# Altium schematic sheet 06-RTL8111H-1.schdoc
size A2
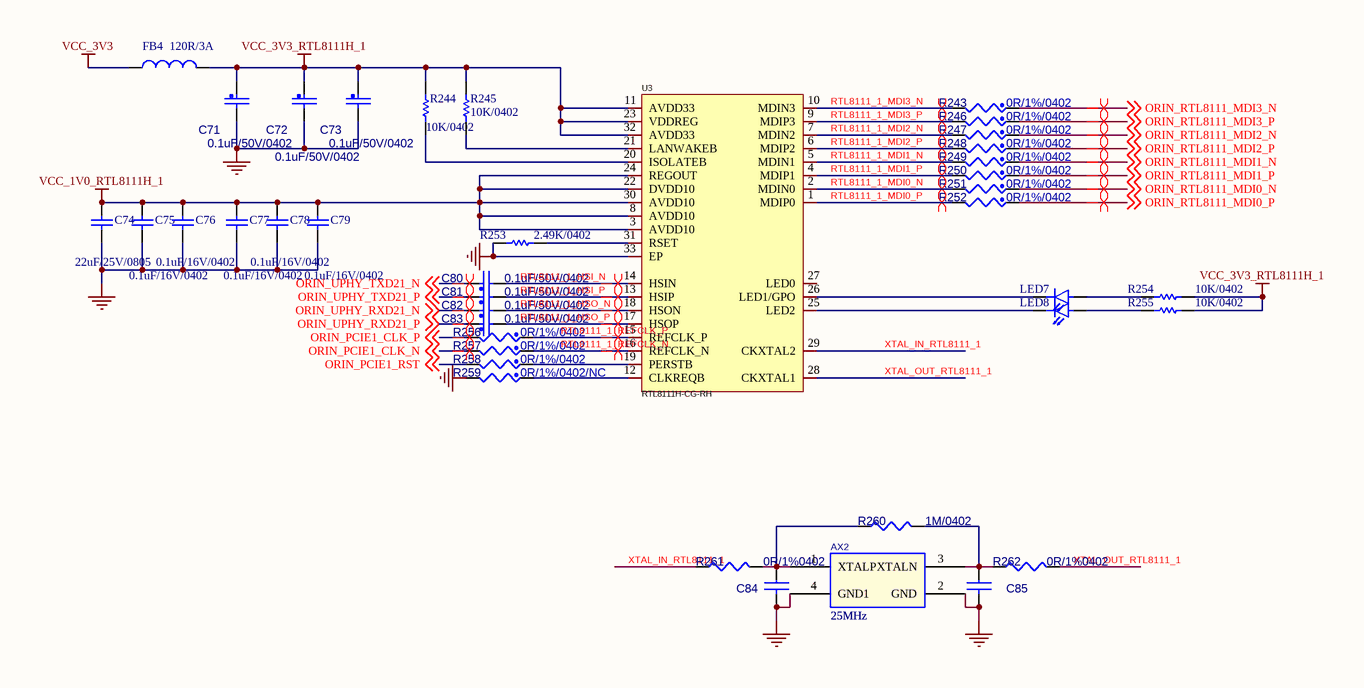
[diagram p0: 06-RTL8111H-1.schdoc]

## Parts
AX2  25MHz  [2016]
C71  value 0.1uF/50V/0402  [C0402]  (hidden comment: CAP_NP)
C72  value 0.1uF/50V/0402  [C0402]  (hidden comment: CAP_NP)
C73  value 0.1uF/50V/0402  [C0402]  (hidden comment: CAP_NP)
C74  22uF/25V/0805  [C0805]
C75  0.1uF/16V/0402  [C0402]
C76  0.1uF/16V/0402  [C0402]
C77  0.1uF/16V/0402  [C0402]
C78  0.1uF/16V/0402  [C0402]
C79  0.1uF/16V/0402  [C0402]
C80  value 0.1uF/50V/0402  [C0402]  (hidden comment: CAP_NP)
C81  value 0.1uF/50V/0402  [C0402]  (hidden comment: CAP_NP)
C82  value 0.1uF/50V/0402  [C0402]  (hidden comment: CAP_NP)
C83  value 0.1uF/50V/0402  [C0402]  (hidden comment: CAP_NP)
C84  CAP NP_Dup3  [C0402]  (value not drawn)
C85  CAP NP_Dup3  [C0402]  (value not drawn)
FB4  120R/3A  [L0603]
LED7  LED_GREEN  [LED0603]  (value not drawn)
LED8  LED_GREEN  [LED0603]  (value not drawn)
R243  value 0R/1%/0402  [R0402]  (hidden comment: RES_Dup2)
R244  10K/0402  [R0402]
R245  10K/0402  [R0402]
R246  value 0R/1%/0402  [R0402]  (hidden comment: RES_Dup2)
R247  value 0R/1%/0402  [R0402]  (hidden comment: RES_Dup2)
R248  value 0R/1%/0402  [R0402]  (hidden comment: RES_Dup2)
R249  value 0R/1%/0402  [R0402]  (hidden comment: RES_Dup2)
R250  value 0R/1%/0402  [R0402]  (hidden comment: RES_Dup2)
R251  value 0R/1%/0402  [R0402]  (hidden comment: RES_Dup2)
R252  value 0R/1%/0402  [R0402]  (hidden comment: RES_Dup2)
R253  2.49K/0402  [R0402]
R254  10K/0402  [R0402]
R255  10K/0402  [R0402]
R256  value 0R/1%/0402  [R0402]  (hidden comment: RES_Dup2)
R257  value 0R/1%/0402  [R0402]  (hidden comment: RES_Dup2)
R258  value 0R/1%/0402  [R0402]  (hidden comment: RES_Dup2)
R259  value 0R/1%/0402/NC  [R0402]  (hidden comment: RES_Dup2)
R260  value 1M/0402  [R0402]  (hidden comment: R_Dup3)
R261  value 0R/1%0402  [R0402]  (hidden comment: R_Dup3)
R262  value 0R/1%0402  [R0402]  (hidden comment: R_Dup3)
U3  RTL8111H-CG-RH  [RTL8111H-CG-RH]

## Nets
GND: AX2.2(GND) AX2.4(GND1) C71.2 C72.2 C73.2 C74.1 C75.1 C76.1 C77.1 C78.1 C79.1 C84.2 C85.2 R253.1 R259.2 U3.33(EP)
VCC_1V0_RTL8111H_1: C74.2 C75.2 C76.2 C77.2 C78.2 C79.2 U3.3(AVDD10) U3.8(AVDD10) U3.22(DVDD10) U3.24(REGOUT) U3.30(AVDD10)
VCC_3V3: FB4.1
VCC_3V3_RTL8111H_1: C71.1 C72.1 C73.1 FB4.2 R244.1 R245.1 R254.1 R255.1 U3.11(AVDD33) U3.23(VDDREG) U3.32(AVDD33)
ORIN_PCIE1_CLK_N: R257.2 ; off-sheet ORIN_PCIE1_CLK_N
ORIN_PCIE1_CLK_P: R256.2 ; off-sheet ORIN_PCIE1_CLK_P
ORIN_PCIE1_RST: R258.2 ; off-sheet ORIN_PCIE1_RST
ORIN_RTL8111_MDI0_N: R251.1 ; off-sheet ORIN_RTL8111_MDI0_N
ORIN_RTL8111_MDI0_P: R252.1 ; off-sheet ORIN_RTL8111_MDI0_P
ORIN_RTL8111_MDI1_N: R249.1 ; off-sheet ORIN_RTL8111_MDI1_N
ORIN_RTL8111_MDI1_P: R250.1 ; off-sheet ORIN_RTL8111_MDI1_P
ORIN_RTL8111_MDI2_N: R247.1 ; off-sheet ORIN_RTL8111_MDI2_N
ORIN_RTL8111_MDI2_P: R248.1 ; off-sheet ORIN_RTL8111_MDI2_P
ORIN_RTL8111_MDI3_N: R243.1 ; off-sheet ORIN_RTL8111_MDI3_N
ORIN_RTL8111_MDI3_P: R246.1 ; off-sheet ORIN_RTL8111_MDI3_P
ORIN_UPHY_RXD21_N: C82.1 ; off-sheet ORIN_UPHY_RXD21_N
ORIN_UPHY_RXD21_P: C83.1 ; off-sheet ORIN_UPHY_RXD21_P
ORIN_UPHY_TXD21_N: C80.1 ; off-sheet ORIN_UPHY_TXD21_N
ORIN_UPHY_TXD21_P: C81.1 ; off-sheet ORIN_UPHY_TXD21_P
RTL8111_1_HSI_N: C80.2 U3.14(HSIN)
RTL8111_1_HSI_P: C81.2 U3.13(HSIP)
RTL8111_1_HSO_N: C82.2 U3.18(HSON)
RTL8111_1_HSO_P: C83.2 U3.17(HSOP)
RTL8111_1_MDI0_N: R251.2 U3.2(MDIN0)
RTL8111_1_MDI0_P: R252.2 U3.1(MDIP0)
RTL8111_1_MDI1_N: R249.2 U3.5(MDIN1)
RTL8111_1_MDI1_P: R250.2 U3.4(MDIP1)
RTL8111_1_MDI2_N: R247.2 U3.7(MDIN2)
RTL8111_1_MDI2_P: R248.2 U3.6(MDIP2)
RTL8111_1_MDI3_N: R243.2 U3.10(MDIN3)
RTL8111_1_MDI3_P: R246.2 U3.9(MDIP3)
RTL8111_1_REFCLK_N: R257.1 U3.16(REFCLK_N)
RTL8111_1_REFCLK_P: R256.1 U3.15(REFCLK_P)
XTAL_IN_RTL8111_1: R261.1 U3.29(CKXTAL2)
XTAL_OUT_RTL8111_1: R262.2 U3.28(CKXTAL1)
NetAX2_1: AX2.1(XTALP) C84.1 R260.1 R261.2
NetAX2_3: AX2.3(XTALN) C85.1 R260.2 R262.1
NetLED7_1: LED7.1 R254.2
NetLED7_2: LED7.2 U3.26(LED1/GPO)
NetLED8_1: LED8.1 R255.2
NetLED8_2: LED8.2 U3.25(LED2)
NetR244_2: R244.2 U3.20(ISOLATEB)
NetR245_2: R245.2 U3.21(LANWAKEB)
NetR253_2: R253.2 U3.31(RSET)
NetR258_1: R258.1 U3.19(PERSTB)
NetR259_1: R259.1 U3.12(CLKREQB)

Not connected (* = marked no-connect by the designer): U3 27(LED0)

## Layout directives
differential pair: ORIN_PCIE1_CLK_N, ORIN_PCIE1_CLK_P, ORIN_RTL8111_MDI0_N, ORIN_RTL8111_MDI0_P, ORIN_RTL8111_MDI1_N, ORIN_RTL8111_MDI1_P, ORIN_RTL8111_MDI2_N, ORIN_RTL8111_MDI2_P, ORIN_RTL8111_MDI3_N, ORIN_RTL8111_MDI3_P, ORIN_UPHY_RXD21_N, ORIN_UPHY_RXD21_P, ORIN_UPHY_TXD21_N, ORIN_UPHY_TXD21_P, RTL8111_1_HSI_N, RTL8111_1_HSI_P, RTL8111_1_HSO_N, RTL8111_1_HSO_P, RTL8111_1_MDI0_N, RTL8111_1_MDI0_P, RTL8111_1_MDI1_N, RTL8111_1_MDI1_P, RTL8111_1_MDI2_N, RTL8111_1_MDI2_P, RTL8111_1_MDI3_N, RTL8111_1_MDI3_P, RTL8111_1_REFCLK_N, RTL8111_1_REFCLK_P

## Library data of the parts
AX2 = XTAL_0: Part Reference: AX3; PCB Footprint: CRY5032; Value: 25MHz
C71-C73 C80-C83 = CAP_NP: GCM155R71H104KE02/MURATA; Part Reference: C15; CLASS: DISCRETE; FPLIST: CC0402_25,CC0402_HD,CC0402_CC; CAD_APPROVED: Yes; MFG_PN01: 0402YC104KAT2A; MFG_NAME01: AVX; Tolerance: 10%; AGILE_PN: 150-75182; VOLTAGE: 16V; HEIGHT: 0.635MM; ROHS: Yes; TOL: 10%; PCB Footprint: C0402
C74-C79 = CAP: Capacitor; Value: 100pF; Published: 8-Jun-2000; Revision: July-2002: Re-released for DXP Platform.; Publisher: Altium Limited
C84 = CAP NP_Dup3: Part Reference: C71; Value: 20pF/50V X7R; PCB Footprint: C0402
C85 = CAP NP_Dup3: Part Reference: C72; Value: 20pF/50V X7R; PCB Footprint: C0402
FB4 = Inductor: BLM18KG121TN1D; Code_IEC: 1005; Value: 10mH; Published: 8-Jun-2000; LatestRevisionDate: 29-May-2009; LatestRevisionNote: IPC-7351 Footprint Added.; PackageReference: 0402-A; Publisher: Altium Limited; PackageDescription: Chip Inductor; Code_JEITA: 0402
LED7 LED8 = LED
R243 R256 = RES_Dup2: AC0402FR-070RL/YAGEO; Part Reference: R97; CLASS: DISCRETE; SIGNAL_MODEL: DEFAULT_RESISTOR_33.000000OHM_2_1; FPLIST: RC0603_OV; CAD_APPROVED: Yes; MFG_PN01: CR-02FL6---33R; MFG_NAME01: YAGEO; Tolerance: 1%; AGILE_PN: 470-75790; TOL: 5%; ROHS: Yes; HEIGHT: 0.4MM; PCB Footprint: R0402
R244 R245 R253 = Res Semi: Semiconductor Resistor; Value: 240R; Published: 8-Jun-2000; LatestRevisionDate: 17-Jul-2002; LatestRevisionNote: Re-released for DXP Platform.; PackageReference: AXIAL-0.5; Publisher: Altium Limited; PackageDescription: Axial Device, Thru-Hole; 2 Leads; 0.5 in Pin Spacing
R246 R257-R259 = RES_Dup2: AC0402FR-070RL/YAGEO; Part Reference: R98; CLASS: DISCRETE; TOL: 5%; AGILE_PN: 470-75790; Tolerance: 1%; MFG_NAME01: YAGEO; MFG_PN01: CR-02FL6---33R; CAD_APPROVED: Yes; FPLIST: RC0603_OV; SIGNAL_MODEL: DEFAULT_RESISTOR_33.000000OHM_2_1; HEIGHT: 0.4MM; ROHS: Yes; PCB Footprint: R0402
R247 = RES_Dup2: AC0402FR-070RL/YAGEO; Part Reference: R99; CLASS: DISCRETE; TOL: 5%; AGILE_PN: 470-75790; Tolerance: 1%; MFG_NAME01: YAGEO; MFG_PN01: CR-02FL6---33R; CAD_APPROVED: Yes; FPLIST: RC0603_OV; SIGNAL_MODEL: DEFAULT_RESISTOR_33.000000OHM_2_1; HEIGHT: 0.4MM; ROHS: Yes; PCB Footprint: R0402
R248 = RES_Dup2: AC0402FR-070RL/YAGEO; Part Reference: R101; CLASS: DISCRETE; TOL: 5%; AGILE_PN: 470-75790; Tolerance: 1%; MFG_NAME01: YAGEO; MFG_PN01: CR-02FL6---33R; CAD_APPROVED: Yes; FPLIST: RC0603_OV; SIGNAL_MODEL: DEFAULT_RESISTOR_33.000000OHM_2_1; HEIGHT: 0.4MM; ROHS: Yes; PCB Footprint: R0402
R249 = RES_Dup2: AC0402FR-070RL/YAGEO; Part Reference: R102; CLASS: DISCRETE; TOL: 5%; AGILE_PN: 470-75790; Tolerance: 1%; MFG_NAME01: YAGEO; MFG_PN01: CR-02FL6---33R; CAD_APPROVED: Yes; FPLIST: RC0603_OV; SIGNAL_MODEL: DEFAULT_RESISTOR_33.000000OHM_2_1; HEIGHT: 0.4MM; ROHS: Yes; PCB Footprint: R0402
R250 = RES_Dup2: AC0402FR-070RL/YAGEO; Part Reference: R103; CLASS: DISCRETE; TOL: 5%; AGILE_PN: 470-75790; Tolerance: 1%; MFG_NAME01: YAGEO; MFG_PN01: CR-02FL6---33R; CAD_APPROVED: Yes; FPLIST: RC0603_OV; SIGNAL_MODEL: DEFAULT_RESISTOR_33.000000OHM_2_1; HEIGHT: 0.4MM; ROHS: Yes; PCB Footprint: R0402
R251 = RES_Dup2: AC0402FR-070RL/YAGEO; Part Reference: R104; CLASS: DISCRETE; TOL: 5%; AGILE_PN: 470-75790; Tolerance: 1%; MFG_NAME01: YAGEO; MFG_PN01: CR-02FL6---33R; CAD_APPROVED: Yes; FPLIST: RC0603_OV; SIGNAL_MODEL: DEFAULT_RESISTOR_33.000000OHM_2_1; HEIGHT: 0.4MM; ROHS: Yes; PCB Footprint: R0402
R252 = RES_Dup2: AC0402FR-070RL/YAGEO; Part Reference: R105; CLASS: DISCRETE; TOL: 5%; AGILE_PN: 470-75790; Tolerance: 1%; MFG_NAME01: YAGEO; MFG_PN01: CR-02FL6---33R; CAD_APPROVED: Yes; FPLIST: RC0603_OV; SIGNAL_MODEL: DEFAULT_RESISTOR_33.000000OHM_2_1; HEIGHT: 0.4MM; ROHS: Yes; PCB Footprint: R0402
R254 R255 = Res Semi: Semiconductor Resistor; Value: 1K; Published: 8-Jun-2000; LatestRevisionDate: 17-Jul-2002; LatestRevisionNote: Re-released for DXP Platform.; PackageReference: AXIAL-0.5; Publisher: Altium Limited; PackageDescription: Axial Device, Thru-Hole; 2 Leads; 0.5 in Pin Spacing
R260 R261 = R_Dup3: Part Reference: R130; PCB Footprint: R0402
R262 = R_Dup3: Part Reference: R131; PCB Footprint: R0402
U3 = RTL8111H-CG: Manufacturer: REALTEK(瑞昱); Add into BOM: yes; Symbol: RTL8111H-CG; Device: RTL8111H-CG; LCSC Part Name: RTL8111H-CG; Supplier Part: C2761340; Manufacturer Part: RTL8111H-CG; Supplier Footprint: QFN-32-EP(4x4); JLCPCB Part Class: Extended Part; Datasheet: https://atta.szlcsc.com/upload/public/pdf/source/20210810/FF05C5D46F518898BC2EC053E52D54B5.pdf; Supplier: LCSC; Convert to PCB: yes; Comment_1: RTL8111H-CG